# EAGLE design GabozeLite (EAGLE 9.5.0)

## Sheet 1 of 7: POWER (SOURCE, BATTERY, CHARGE, CONTROL)
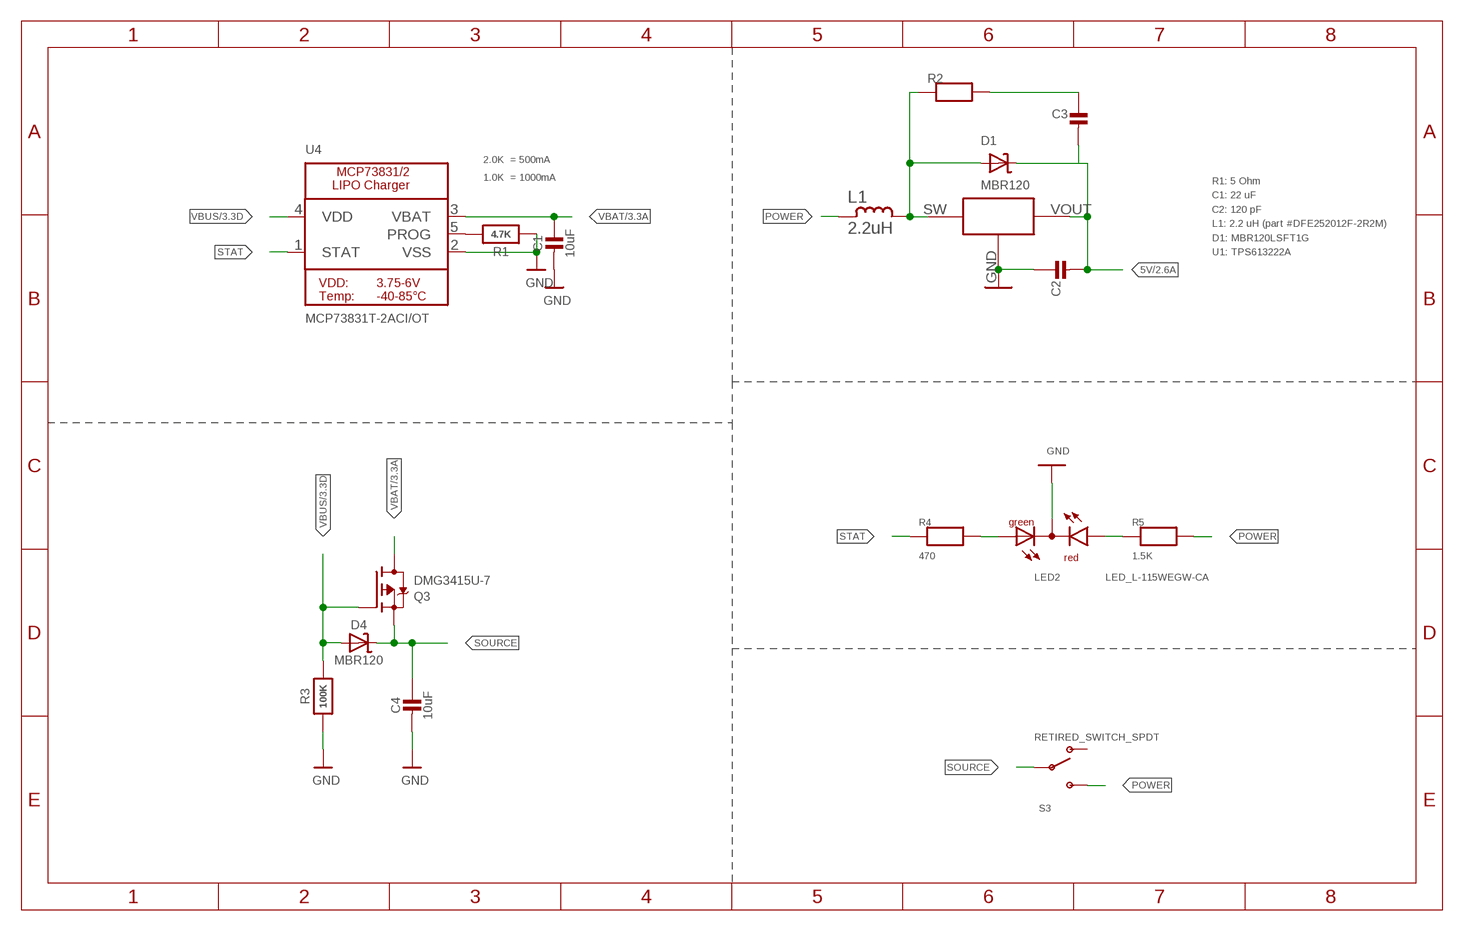
[diagram p0: schematic, sheet 1]

### Parts
C1  10uF  CAP_CERAMIC  [0603-MINI-CAP]
C2  22uf  CAP_CERAMIC  [0603-MINI-CAP]
C3  120pf  CAP_CERAMIC  [0603-MINI-CAP]
C4  10uF  CAP_CERAMIC  [0603-MINI-CAP]
D1  MBR120  DIODE-SCHOTTKYSOD-123  [SOD-123]
D4  MBR120  DIODE-SCHOTTKYSOD-123  [SOD-123]
L1  2.2uH  L-1008CS  [L1008CS]
LED2  LED_L-115WEGW-CA  [LED_DUOLED-A-3MM]
Q3  DMG3415U-7  MOSFET-P  [SOT23-R]
R1  4.7K  RESISTOR0603MINI  [0603-MINI]
R2  5Ohm  RESISTOR0603MINI  [0603-MINI]
R3  100K  RESISTOR0603MINI  [0603-MINI]
R4  470  RESISTOR0603MINI  [0603-MINI]
R5  1.5K  RESISTOR0603MINI  [0603-MINI]
S3  RETIRED_SWITCH_SPDT  [RETIRED_KPS-1290]
U1  TPS613222A  [TPS613222A]
U4  MCP73831T-2ACI/OT  MCP73831/2  [SOT23-5-1]

### Nets
5V: C2.2 C3.2 D1.C U1.VOUT ; also sheet 2
GND: C1.2 C2.1 C4.2 LED2.2(A) R1.1 R3.1 U1.GND U4.2(VSS) ; also sheet 2,3,4,5,6
N$1: D1.A L1.2 R2.1 U1.SW
N$2: C3.1 R2.2
POWER: L1.1 R5.2 S3.S
POWER_LED: LED2.3(CR) R5.1
PROG: R1.2 U4.5(PROG)
SOURCE: C4.1 D4.C Q3.2(S) S3.P
STAT: R4.1 U4.1(STAT)
STAT_LED: LED2.1(CG) R4.2
VBAT: C1.1 Q3.3(D) U4.3(VBAT) ; also sheet 3
VBUS: D4.A Q3.1(G) R3.2 U4.4(VDD) ; also sheet 3
Unconnected: S3.O

### Notes on the sheet
- 2.0K  = 500mA
- 1.0K  = 1000mA
- R1: 5 Ohm
  C1: 22 uF
  C2: 120 pF
  L1: 2.2 uH (part #DFE252012F-2R2M)
  D1: MBR120LSFT1G
  U1: TPS613222A

## Sheet 2 of 7
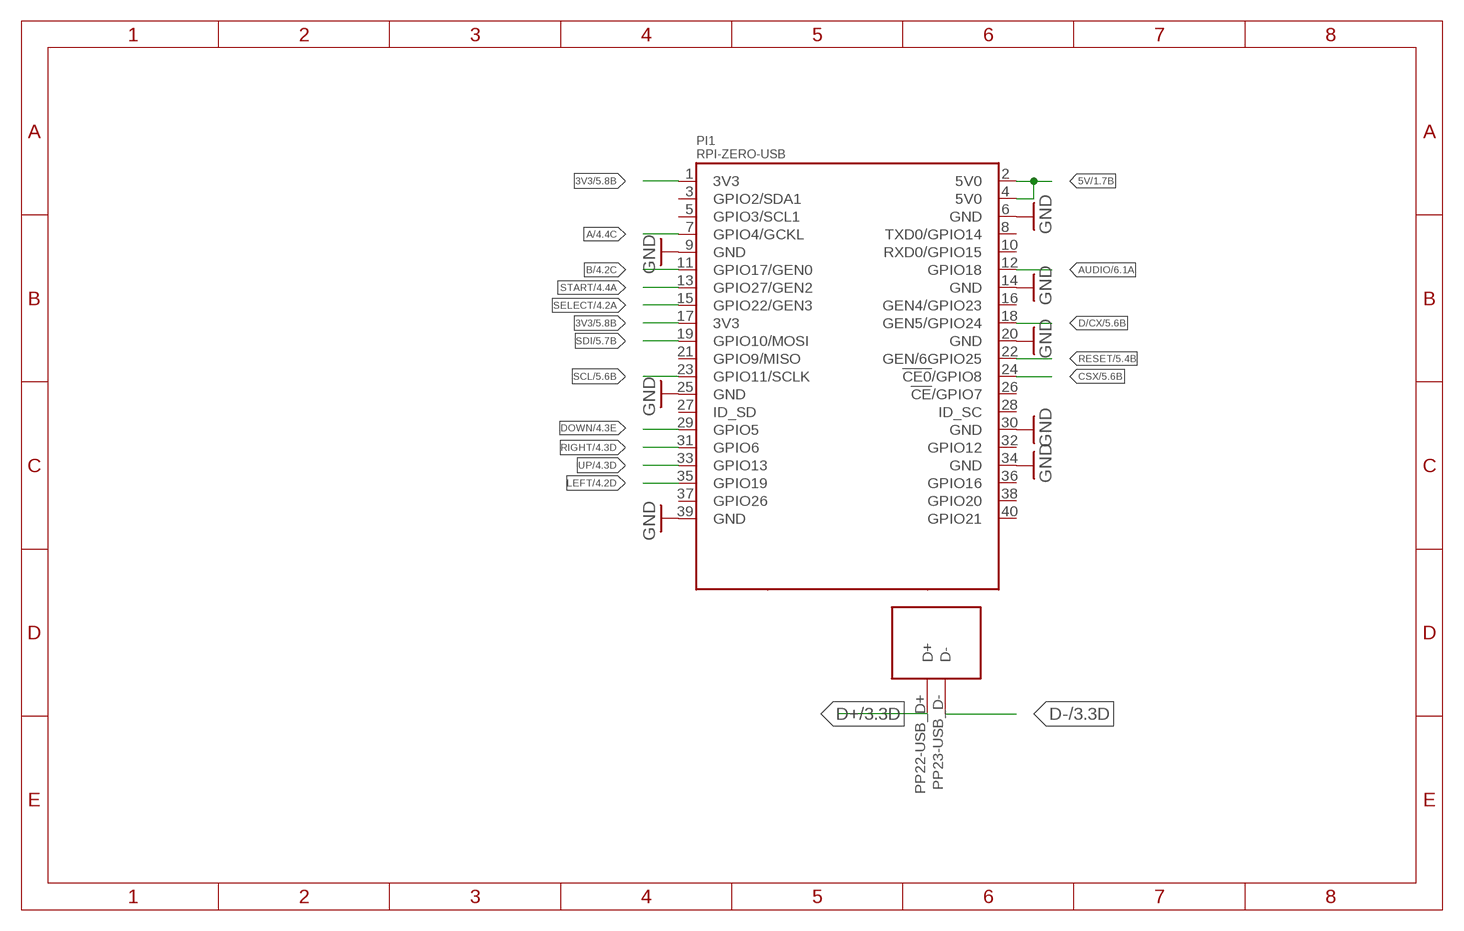
[diagram p1: schematic, sheet 2]

### Parts
PI1  RPI-ZERO-USB  [RPI-ZERO-TH-USB-POGO]

### Nets
3V3: PI1.1(3V3) PI1.17(3V3) ; also sheet 5,6
5V: PI1.2(5V0) PI1.4(5V0) ; also sheet 1
A: PI1.7(GPIO4/GCKL) ; also sheet 4
AUDIO: PI1.12(GPIO18) ; also sheet 6
B: PI1.11(GPIO17/GEN0) ; also sheet 4
CSX: PI1.24(!CE0!/GPIO8) ; also sheet 5
D+: PI1.PP22-USB_D+(D+) ; also sheet 3
D-: PI1.PP23-USB_D-(D-) ; also sheet 3
D/CX: PI1.18(GEN5/GPIO24) ; also sheet 5
DOWN: PI1.29(GPIO5) ; also sheet 4
GND: PI1.6(GND) PI1.9(GND) PI1.14(GND) PI1.20(GND) PI1.25(GND) PI1.30(GND) PI1.34(GND) PI1.39(GND) ; also sheet 1,3,4,5,6
LEFT: PI1.35(GPIO19) ; also sheet 4
RESET: PI1.22(GEN/6GPIO25) ; also sheet 5
RIGHT: PI1.31(GPIO6) ; also sheet 4
SCL: PI1.23(GPIO11/SCLK) ; also sheet 5
SDI: PI1.19(GPIO10/MOSI) ; also sheet 5
SELECT: PI1.15(GPIO22/GEN3) ; also sheet 4
START: PI1.13(GPIO27/GEN2) ; also sheet 4
UP: PI1.33(GPIO13) ; also sheet 4
Unconnected: PI1.3(GPIO2/SDA1) PI1.5(GPIO3/SCL1) PI1.8(TXD0/GPIO14) PI1.10(RXD0/GPIO15) PI1.16(GEN4/GPIO23) PI1.21(GPIO9/MISO) PI1.26(!CE!/GPIO7) PI1.27(ID_SD) PI1.28(ID_SC) PI1.32(GPIO12) PI1.36(GPIO16) PI1.37(GPIO26) PI1.38(GPIO20) PI1.40(GPIO21)

## Sheet 3 of 7: USB + BATTERY
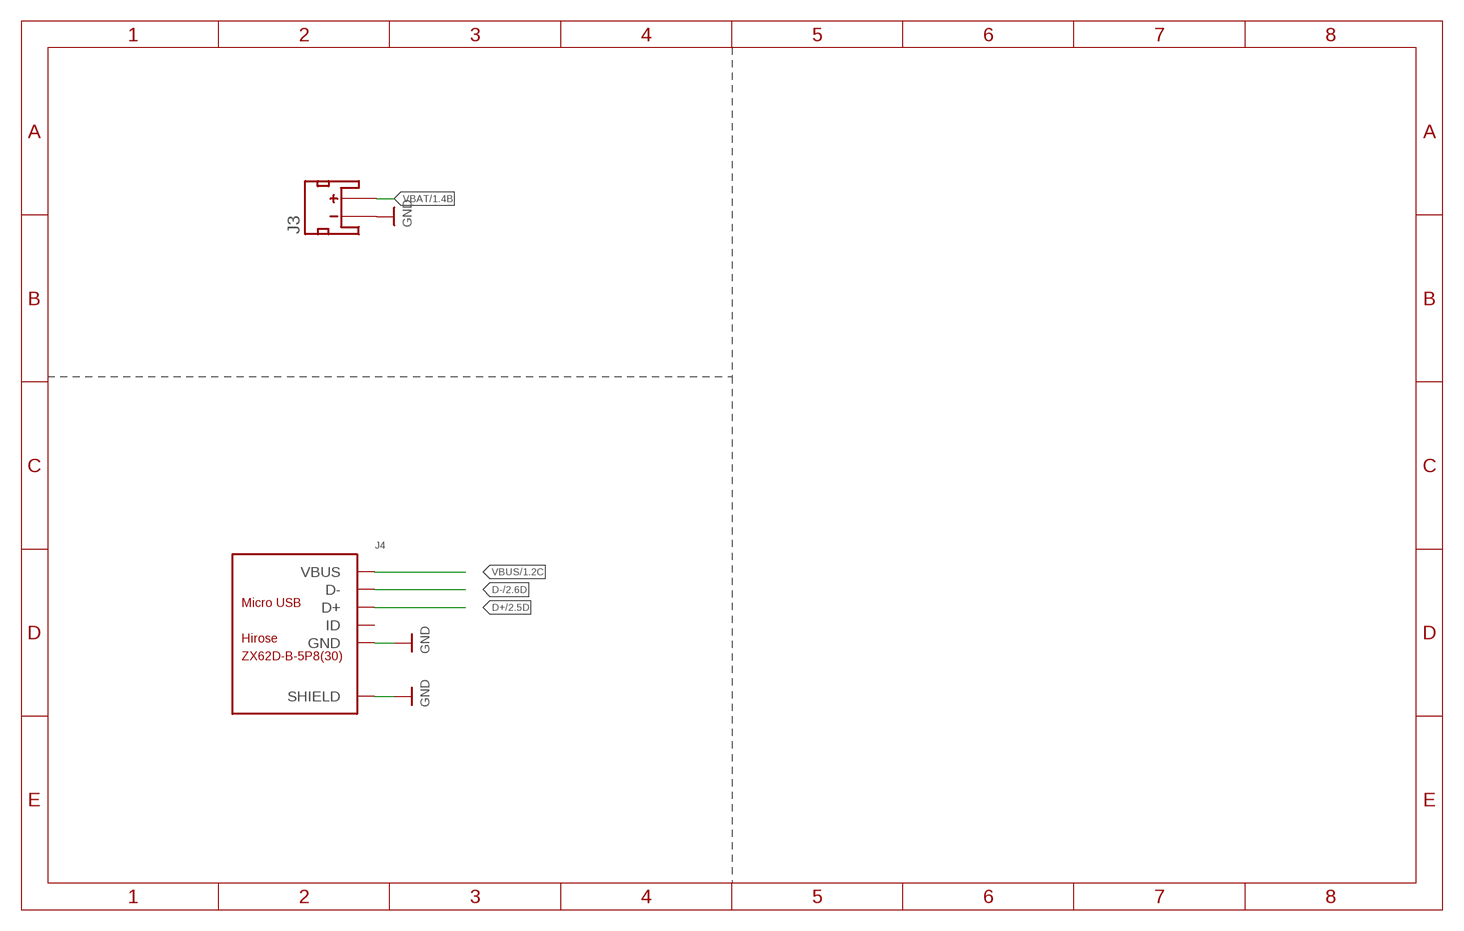
[diagram p2: schematic, sheet 3]

### Parts
J3  Batt Conn  JST_2MM_MALE  [JST-2-SMD]
J4  ZX62D-B-5P8(30)  MICRO-USB-SMD(ZX62D-B-5P8(30))  [MICRO-USB5+6P-SMD-0.65-AB]

### Nets
D+: J4.3(D+) ; also sheet 2
D-: J4.2(D-) ; also sheet 2
GND: J3.1(-) J4.5(GND) J4.P1(SHIELD) J4.P2(SHIELD) J4.P3(SHIELD) J4.P4(SHIELD) J4.P5(SHIELD) J4.P6(SHIELD) ; also sheet 1,2,4,5,6
VBAT: J3.2(+) ; also sheet 1
VBUS: J4.1(VBUS) ; also sheet 1
Unconnected: J3.NC1(PAD1) J3.NC2(PAD2) J4.4(ID)

## Sheet 4 of 7: GPIO
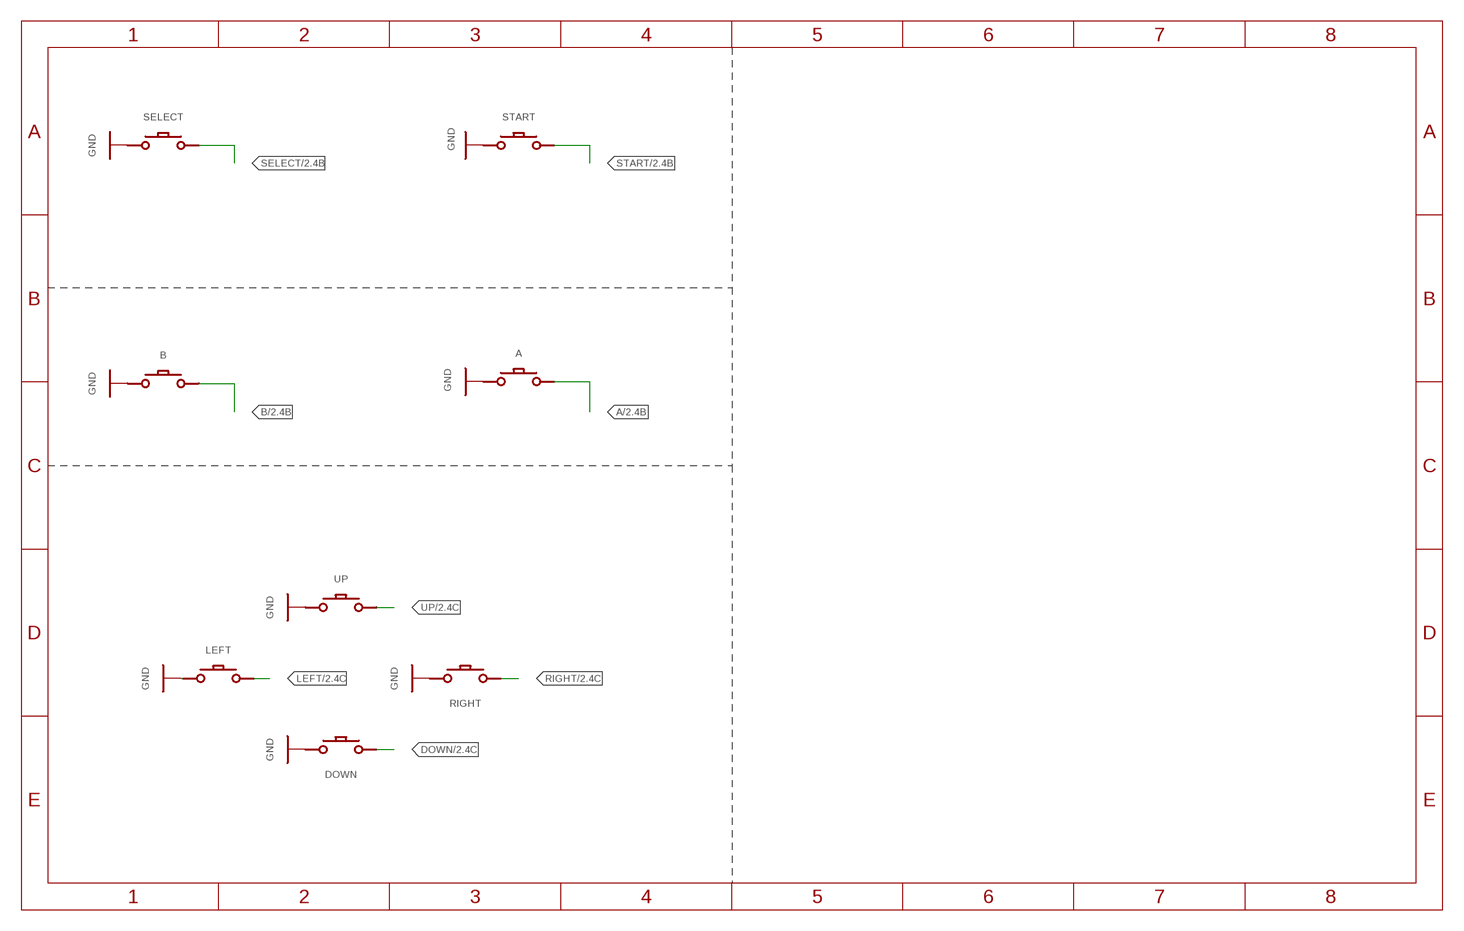
[diagram p3: schematic, sheet 4]

### Parts
A  CONDUCTIVE_BUTTONCONDUCTIVE_BUTTON_THICK  [CONDUCTIVE_BUTTON_THICK]
B  CONDUCTIVE_BUTTONCONDUCTIVE_BUTTON_THICK  [CONDUCTIVE_BUTTON_THICK]
DOWN  CONDUCTIVE_BUTTONCONDUCTIVE_BUTTON_DIRECTIONAL_THICK  [CONDUCTIVE_BUTTON_DIRECTIONAL_THICK]
LEFT  CONDUCTIVE_BUTTONCONDUCTIVE_BUTTON_DIRECTIONAL_THICK  [CONDUCTIVE_BUTTON_DIRECTIONAL_THICK]
RIGHT  CONDUCTIVE_BUTTONCONDUCTIVE_BUTTON_DIRECTIONAL_THICK  [CONDUCTIVE_BUTTON_DIRECTIONAL_THICK]
SELECT  CONDUCTIVE_BUTTON_STARTSELECTCONDUCTIVE_BUTTON_THICK_STARTSELECT  [CONDUCTIVE_BUTTON_THICK_STARTSELECT]
START  CONDUCTIVE_BUTTON_STARTSELECTCONDUCTIVE_BUTTON_THICK_STARTSELECT  [CONDUCTIVE_BUTTON_THICK_STARTSELECT]
UP  CONDUCTIVE_BUTTONCONDUCTIVE_BUTTON_DIRECTIONAL_THICK  [CONDUCTIVE_BUTTON_DIRECTIONAL_THICK]

### Nets
A: A.P$ACTIVE ; also sheet 2
B: B.P$ACTIVE ; also sheet 2
DOWN: DOWN.P$ACTIVE ; also sheet 2
GND: A.P$GND B.P$GND DOWN.P$GND LEFT.P$GND RIGHT.P$GND SELECT.P$GND SELECT.P$GND1(P$GND) SELECT.P$GND2(P$GND) SELECT.P$GND3(P$GND) START.P$GND START.P$GND1(P$GND) START.P$GND2(P$GND) START.P$GND3(P$GND) UP.P$GND ; also sheet 1,2,3,5,6
LEFT: LEFT.P$ACTIVE ; also sheet 2
RIGHT: RIGHT.P$ACTIVE ; also sheet 2
SELECT: SELECT.P$ACTIVE SELECT.P$ACTIVE1(P$ACTIVE) SELECT.P$ACTIVE2(P$ACTIVE) SELECT.P$ACTIVE3(P$ACTIVE) SELECT.P$ACTIVE4(P$ACTIVE) SELECT.P$ACTIVE5(P$ACTIVE) SELECT.P$ACTIVE6(P$ACTIVE) ; also sheet 2
START: START.P$ACTIVE START.P$ACTIVE1(P$ACTIVE) START.P$ACTIVE2(P$ACTIVE) START.P$ACTIVE3(P$ACTIVE) START.P$ACTIVE4(P$ACTIVE) START.P$ACTIVE5(P$ACTIVE) START.P$ACTIVE6(P$ACTIVE) ; also sheet 2
UP: UP.P$ACTIVE ; also sheet 2

## Sheet 5 of 7: SCREEN + BRIGHTNESS
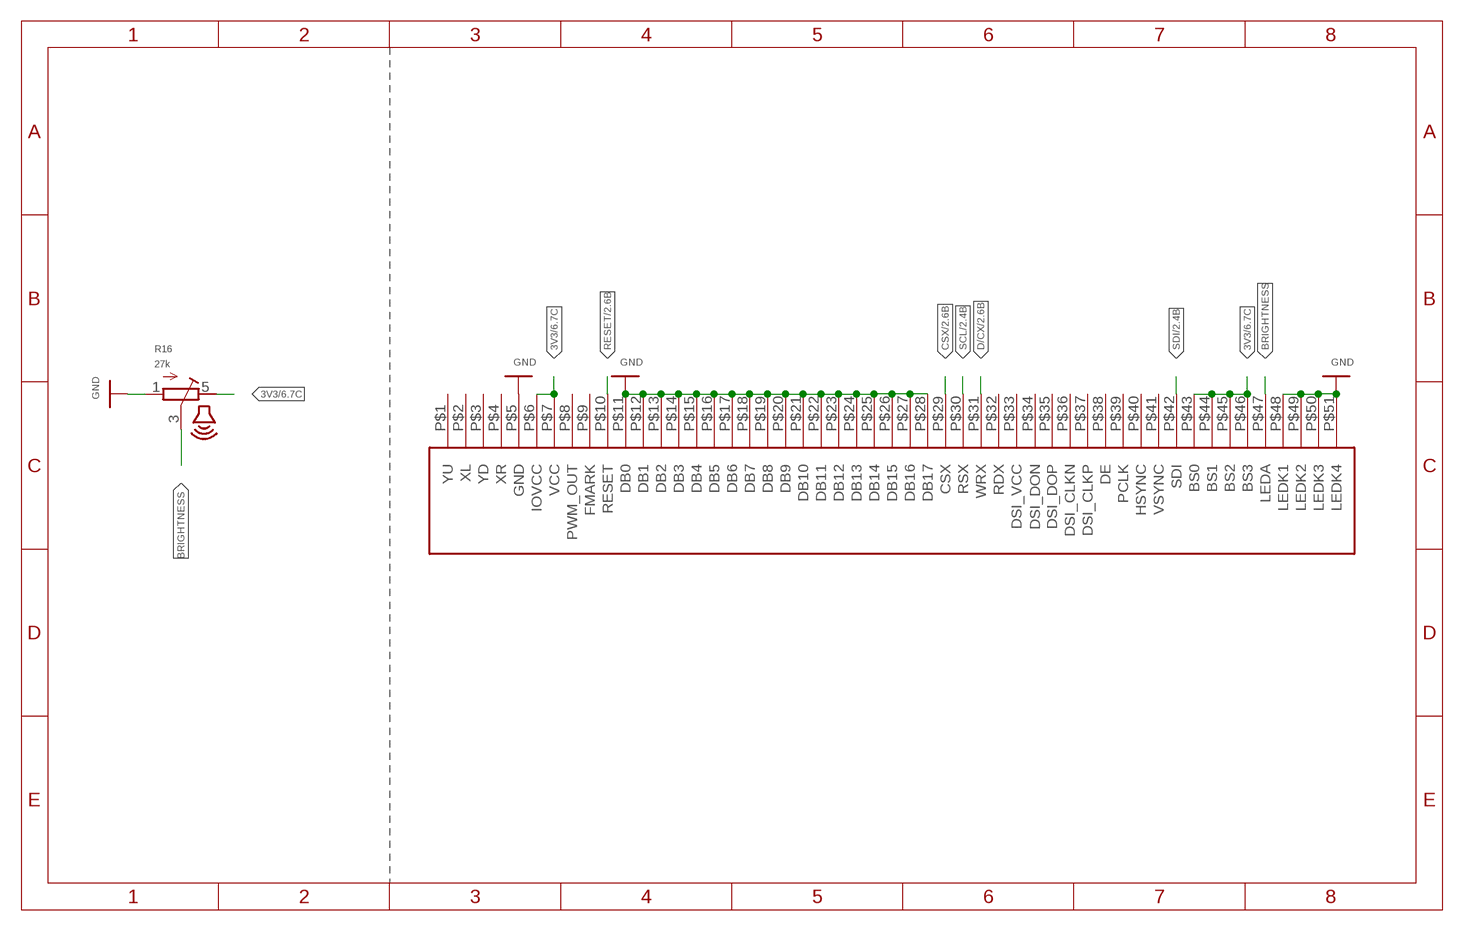
[diagram p4: schematic, sheet 5]

### Parts
R16  27k  THUMBWHEEL  [THUMBWHEEL]
U5  ILI9342-2.6"  [ILI9342-2.6"]

### Nets
3V3: R16.5(E) U5.P$6(IOVCC) U5.P$7(VCC) U5.P$43(BS0) U5.P$44(BS1) U5.P$45(BS2) U5.P$46(BS3) ; also sheet 2,6
BRIGHTNESS: R16.3(S) U5.P$47(LEDA)
CSX: U5.P$29(CSX) ; also sheet 2
D/CX: U5.P$31(WRX) ; also sheet 2
GND: R16.1(A) U5.P$5(GND) U5.P$11(DB0) U5.P$12(DB1) U5.P$13(DB2) U5.P$14(DB3) U5.P$15(DB4) U5.P$16(DB5) U5.P$17(DB6) U5.P$18(DB7) U5.P$19(DB8) U5.P$20(DB9) U5.P$21(DB10) U5.P$22(DB11) U5.P$23(DB12) U5.P$24(DB13) U5.P$25(DB14) U5.P$26(DB15) U5.P$27(DB16) U5.P$28(DB17) U5.P$48(LEDK1) U5.P$49(LEDK2) U5.P$50(LEDK3) U5.P$51(LEDK4) ; also sheet 1,2,3,4,6
RESET: U5.P$10(RESET) ; also sheet 2
SCL: U5.P$30(RSX) ; also sheet 2
SDI: U5.P$42(SDI) ; also sheet 2
Unconnected: U5.P$1(YU) U5.P$2(XL) U5.P$3(YD) U5.P$4(XR) U5.P$8(PWM_OUT) U5.P$9(FMARK) U5.P$32(RDX) U5.P$33(DSI_VCC) U5.P$34(DSI_DON) U5.P$35(DSI_DOP) U5.P$36(DSI_CLKN) U5.P$37(DSI_CLKP) U5.P$38(DE) U5.P$39(PCLK) U5.P$40(HSYNC) U5.P$41(VSYNC)

## Sheet 6 of 7: AUDIO
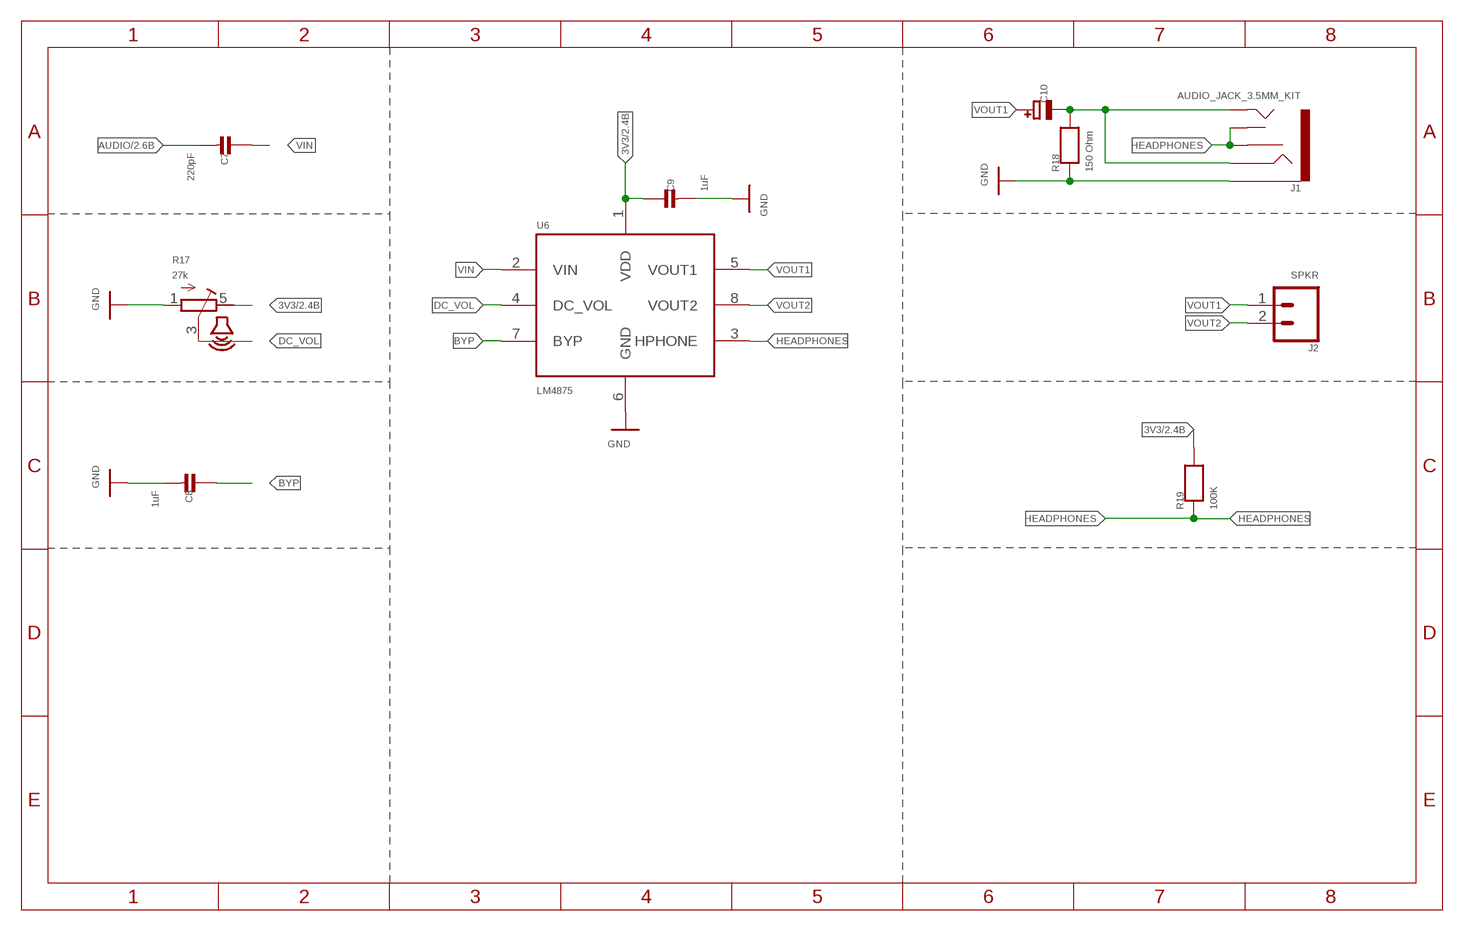
[diagram p5: schematic, sheet 6]

### Parts
C7  220pF  CAP_CERAMIC  [0603-MINI-CAP]
C8  1uF  CAP_CERAMIC  [0603-MINI-CAP]
C9  1uF  CAP_CERAMIC  [0603-MINI-CAP]
C10  100uF  CAP_TANTALUMA/3216_WAVE  [EIA3216-18/A-W]
J1  AUDIO_JACK_3.5MM_KIT  [AUDIO-JACK-KIT]
J2  SPKR  CONN_02  [1X02]
R17  27k  THUMBWHEEL  [THUMBWHEEL]
R18  150 Ohm  RESISTOR0603MINI  [0603-MINI]
R19  100K  RESISTOR0603MINI  [0603-MINI]
U6  LM4875  [SOIC8]

### Nets
3V3: C9.1 R17.5(E) R19.2 U6.1(VDD) ; also sheet 2,5
AUDIO: C7.2 ; also sheet 2
BYP: C8.1 U6.7(BYP)
DC_VOL: R17.3(S) U6.4(DC_VOL)
GND: C8.2 C9.2 J1.SLEEVE R17.1(A) R18.1 U6.6(GND) ; also sheet 1,2,3,4,5
HEADPHONES: J1.RSH J1.TSH R19.1 U6.3(HPHONE)
VIN: C7.1 U6.2(VIN)
VIN1: C10.- J1.RING J1.TIP R18.2
VOUT1: C10.+ J2.1 U6.5(VOUT1)
VOUT2: J2.2 U6.8(VOUT2)

## Sheet 7 of 7: BOARD
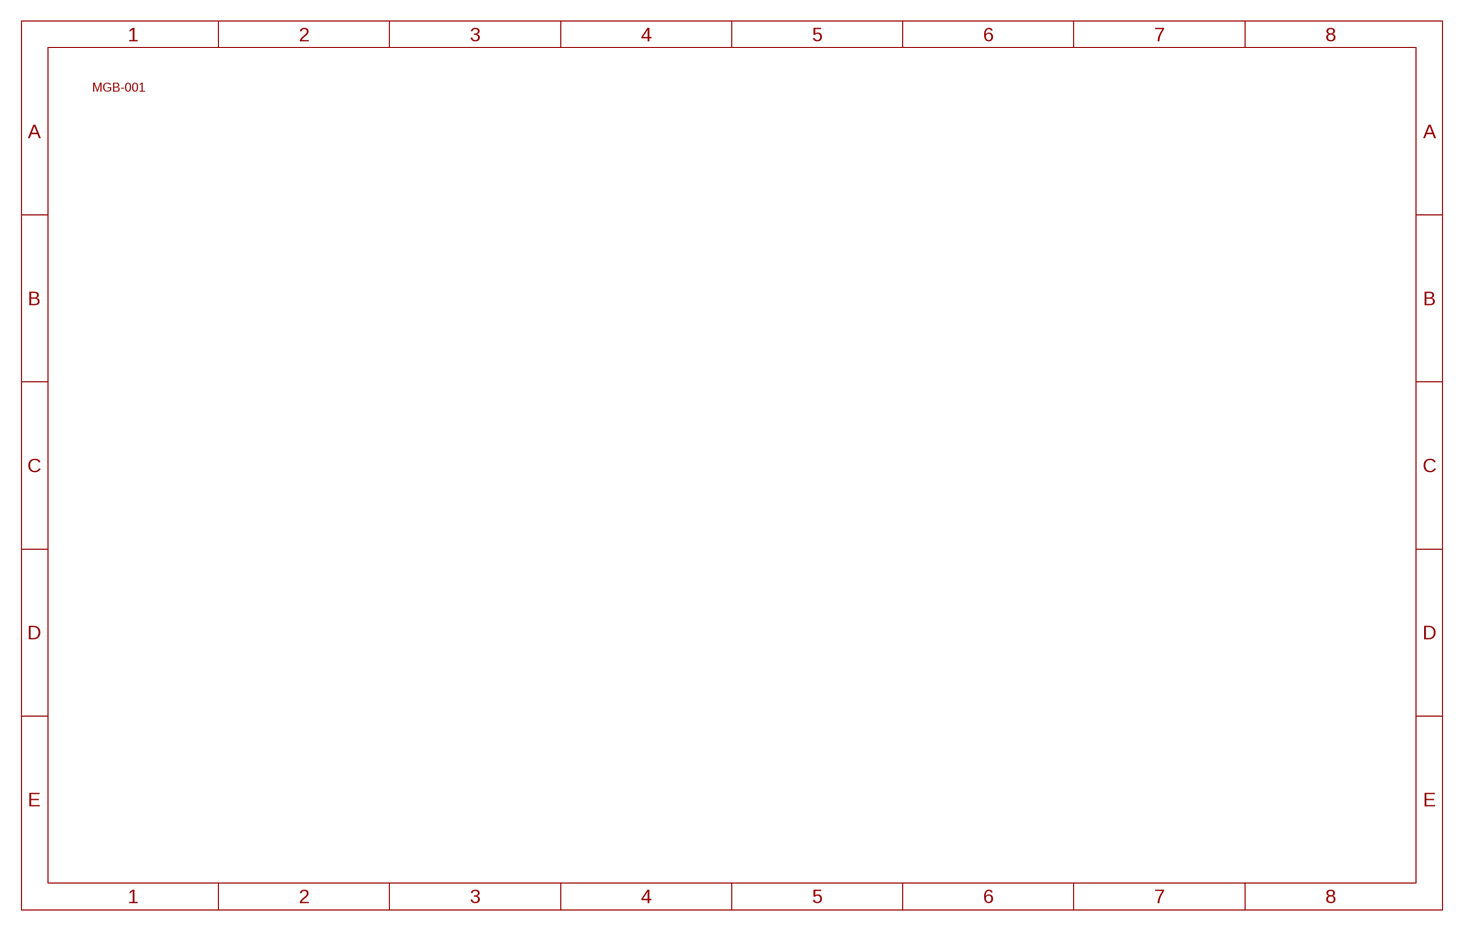
[diagram p6: schematic, sheet 7]

### Parts
U$1  MGB-001  [MGB-001]

## Library data of the parts
A B DOWN LEFT RIGHT UP = RetroESP32:CONDUCTIVE_BUTTON
C1 C4 = RetroESP32:CAP_CERAMIC: Ceramic Capacitors For new designs, use the packages preceded by an '_' character since they are more reliable: The following footprints should be used on most boards: _0402 - Standard footprint for regular board layouts _0603 - Standard footprint for regular board layouts _0805 - Standard footprint for regular board layouts _1206 - Standard footprint for regular board layouts For extremely tight-pitch boards where space is at a premium, the following 'micro-pitch' footprints can be used (smaller pads, no silkscreen outline, etc.): _0402MP - Micro-pitch footprint for very dense/compact boards _0603MP - Micro-pitch footprint for very dense/compact boards _0805MP - Micro-pitch footprint for very dense/compact boards _1206MP - Micro-pitch footprint for very dense/compact boards; MPN: CL10A106MP8NNNC
C2 C3 = RetroESP32:CAP_CERAMIC: Ceramic Capacitors For new designs, use the packages preceded by an '_' character since they are more reliable: The following footprints should be used on most boards: _0402 - Standard footprint for regular board layouts _0603 - Standard footprint for regular board layouts _0805 - Standard footprint for regular board layouts _1206 - Standard footprint for regular board layouts For extremely tight-pitch boards where space is at a premium, the following 'micro-pitch' footprints can be used (smaller pads, no silkscreen outline, etc.): _0402MP - Micro-pitch footprint for very dense/compact boards _0603MP - Micro-pitch footprint for very dense/compact boards _0805MP - Micro-pitch footprint for very dense/compact boards _1206MP - Micro-pitch footprint for very dense/compact boards
C7 = RetroESP32:CAP_CERAMIC: Ceramic Capacitors For new designs, use the packages preceded by an '_' character since they are more reliable: The following footprints should be used on most boards: _0402 - Standard footprint for regular board layouts _0603 - Standard footprint for regular board layouts _0805 - Standard footprint for regular board layouts _1206 - Standard footprint for regular board layouts For extremely tight-pitch boards where space is at a premium, the following 'micro-pitch' footprints can be used (smaller pads, no silkscreen outline, etc.): _0402MP - Micro-pitch footprint for very dense/compact boards _0603MP - Micro-pitch footprint for very dense/compact boards _0805MP - Micro-pitch footprint for very dense/compact boards _1206MP - Micro-pitch footprint for very dense/compact boards; MPN: CL10C221JB8NNNC
C8 C9 = RetroESP32:CAP_CERAMIC: Ceramic Capacitors For new designs, use the packages preceded by an '_' character since they are more reliable: The following footprints should be used on most boards: _0402 - Standard footprint for regular board layouts _0603 - Standard footprint for regular board layouts _0805 - Standard footprint for regular board layouts _1206 - Standard footprint for regular board layouts For extremely tight-pitch boards where space is at a premium, the following 'micro-pitch' footprints can be used (smaller pads, no silkscreen outline, etc.): _0402MP - Micro-pitch footprint for very dense/compact boards _0603MP - Micro-pitch footprint for very dense/compact boards _0805MP - Micro-pitch footprint for very dense/compact boards _1206MP - Micro-pitch footprint for very dense/compact boards; MPN: CL10A105KP8NNNC
C10 = RetroESP32:CAP_TANTALUM: Tantalum Capacitors Wave footprints have larger pads and are meant to be used for hand soldering. Reflow footprints are optimised for solder paste and a reflow oven. EIA3216-18/A-[R/W] - Size A / 3216-18 / 1206 footprint 4.7µF 25V 10% Tantalum Capacitor 10µF 16V 10% Tantalum Capacitor [Digikey: 495-2236-2-ND] EIA3528-21/B-[R/W] - Size B / 3528-21 47µF 10V 10% Tantalum Capactior [Digikey: 495-2216-1-ND] EIA6032-28/C-[R/W] - Size C / 6032-28 10µF 35V 20% Tantalum Capacitor [Digikey: 495-2285-1-ND] 100µF 16V 10% Tantalum Capactior [Digikey: 399-5214-1-ND]; MPN: 6TPH100MAEA
D1 D4 = RetroESP32:DIODE-SCHOTTKY; MPN: MBR120LSFT1G
J1 = RetroESP32:AUDIO_JACK_3.5MM: Audio Jack 3.5mm variants of PTH and SMT stereo audio jack with bypass switches. SparkFun Products: SparkFun SparkPunk Sound Kit <[https://www.sparkfun.com/products/11177]> - PTH MP3 Trigger <https://www.sparkfun.com/products/13720> -3.5mm SMD SparkFun PicoBoard <https://www.sparkfun.com/products/11888>- 2.5mm SMD; MPN: SJ1-3525NG-GR; PROD_ID: CONN-10353; SF_ID: PRT-08032
J2 = RetroESP32:CONN_02: Multi connection point. Often used as Generic Header-pin footprint for 0.1 inch spaced/style header connections On any of the 0.1 inch spaced packages, you can populate with these: Break Away Headers - Straight <https://www.sparkfun.com/products/116> (PRT-00116) Break Away Male Headers - Right Angle <https://www.sparkfun.com/products/553> (PRT-00553) Female Headers <https://www.sparkfun.com/products/115> (PRT-00115) Break Away Headers - Machine Pin <https://www.sparkfun.com/products/117> (PRT-00117) Break Away Female Headers - Swiss Machine Pin <https://www.sparkfun.com/products/743> (PRT-00743) For SCREWTERMINALS and SPRING TERMINALS visit here: Screw Terimnals on SparkFun.com <https://www.sparkfun.com/search/results?term=Screw+Terminals> (5mm/3.5mm/2.54mm spacing) This device is also useful as a general connection point to wire up your design to another part of your project. Our various solder wires solder well into these plated through hole pads. Hook-Up Wire - Assortment (Stranded, 22 AWG) <https://www.sparkfun.com/products/11375> (PRT-11375) Hook-Up Wire - Assortment (Solid Core, 22 AWG) <https://www.sparkfun.com/products/11367> (PRT-11367) View the entire wire category on our website here <https://www.sparkfun.com/categories/141> Special notes: Molex polarized connector foot print use with: PRT-08233 with associated crimp pins and housings. 2.54_SCREWTERM for use with PRT-10571. 3.5mm Screw Terminal footprints for PRT-08084 5mm Screw Terminal footprints for use with PRT-08432; PROD_ID: CONN-13512; SF_ID: PRT-09918; SF_SKU: PRT-08432; SKU: PRT-09914
J3 = RetroESP32:JST_2MM_MALE: JST 2MM MALE RA CONNECTOR Two pin, compact surface mount connector. Commonly used as a battery input connection point. We really like the solid locking feeling and high current rating on these small connectors. We use these all the time as battery connectors. Mates to single-cell LiPo batteries. Here is the connector we sell at SparkFun: JST Right Angle Connector - White <https://www.sparkfun.com/products/8612> (PRT-08612) Datasheet <http://www.sparkfun.com/datasheets/Prototyping/Connectors/JST-Horizontal.pdf> It was used on these SparkFun products: SparkFun MOSFET Power Controller <https://www.sparkfun.com/products/11214> (PRT-11214) SparkFun Battery Babysitter - LiPo Battery Manager <https://www.sparkfun.com/products/13777> (PRT-13777) And many, many others that required a lipo battery connection.; MPN: S2B-PH-SM4-TB(LF)(SN); PROD_ID: CONN-11443; SF_ID: PRT-08612
J4 = RetroESP32:MICRO-USB-SMD(ZX62D-B-5P8(30)): 320010005; MPN: ZX62D-B-5P8(30)
L1 = inductor-coilcraft:L-: SMD INDUCTOR
LED2 = RetroESP32:LED_L-115WEGW-CA: T-1(3mm) BI-COLOR INDICATOR LAMP Source: Kingbright .. 2_colour_led_.pdf; MPN: SSL-LX3059IGW
PI1 = 32teeth - Gaboze-Pi:RPI-ZERO-USB
Q3 = RetroESP32:MOSFET-P: P-Channel Mosfet LEGEND VDS: Voltage Drain-Source ID: Drain Current RDS(ON): Drain-Source On-State Resistance VGS(TH): Gate-Source Threshold Voltage CISS: Drain-Source Input Capacitance SOT-23 Name VDS ID RDS(ON) VGS(TH) CISS Order Number IRLML5103 30V 760mA 600 mOhm -- 75pF @ 25V Digikey: IRLML5103PBFCT-ND IRLML6401 12V 4.3A 50 mOhm 950mV @ 250µA 830pF @ 10V Digikey: IRLML6401PBFTR-ND NTR0202PL 20V 400mA 800 mOhm 2.3V @ 250uA 70pF @ 5V Digikey: NTR0202PLT1GOSTR-ND NTR4101PT1G 20V 1.8A 85 mOhm 1.2V @ 250uA 675pF @ 10V Digikey: NTR4101PT1GOSCT-ND DMP2004K 20V 600mA 900 mOhm 1V @ 250uA 175pF @ 16V Digikey: DMP2004KDICT-ND PMV65XP 20V 3.9A 76 mOhm 950mV @ 1mA 725pF @ 20V Digikey: 568-2358-2-ND TO-252 Name VDS ID RDS(ON) VGS(TH) CISS Order Number AOD417 30V 25A 34 mOhm 3V @ 250µA 920pF @ 15V Digikey: 785-1106-2-ND; MPN: DMG3415U-7
R1 = RetroESP32:RESISTOR: Resistors For new designs, use the packages preceded by an '_' character since they are more reliable: The following footprints should be used on most boards: _0402 - Standard footprint for regular board layouts _0603 - Standard footprint for regular board layouts _0805 - Standard footprint for regular board layouts _1206 - Standard footprint for regular board layouts For extremely tight-pitch boards where space is at a premium, the following 'micro-pitch' footprints can be used (smaller pads, no silkscreen outline, etc.): _0402MP - Micro-pitch footprint for very dense/compact boards _0603MP - Micro-pitch footprint for very dense/compact boards _0805MP - Micro-pitch footprint for very dense/compact boards _1206MP - Micro-pitch footprint for very dense/compact boards; MPN: ERJ-PA3J472V
R2 = RetroESP32:RESISTOR: Resistors For new designs, use the packages preceded by an '_' character since they are more reliable: The following footprints should be used on most boards: _0402 - Standard footprint for regular board layouts _0603 - Standard footprint for regular board layouts _0805 - Standard footprint for regular board layouts _1206 - Standard footprint for regular board layouts For extremely tight-pitch boards where space is at a premium, the following 'micro-pitch' footprints can be used (smaller pads, no silkscreen outline, etc.): _0402MP - Micro-pitch footprint for very dense/compact boards _0603MP - Micro-pitch footprint for very dense/compact boards _0805MP - Micro-pitch footprint for very dense/compact boards _1206MP - Micro-pitch footprint for very dense/compact boards
R3 R19 = RetroESP32:RESISTOR: Resistors For new designs, use the packages preceded by an '_' character since they are more reliable: The following footprints should be used on most boards: _0402 - Standard footprint for regular board layouts _0603 - Standard footprint for regular board layouts _0805 - Standard footprint for regular board layouts _1206 - Standard footprint for regular board layouts For extremely tight-pitch boards where space is at a premium, the following 'micro-pitch' footprints can be used (smaller pads, no silkscreen outline, etc.): _0402MP - Micro-pitch footprint for very dense/compact boards _0603MP - Micro-pitch footprint for very dense/compact boards _0805MP - Micro-pitch footprint for very dense/compact boards _1206MP - Micro-pitch footprint for very dense/compact boards; MPN: ERJ-PA3J104V
R4 = RetroESP32:RESISTOR: Resistors For new designs, use the packages preceded by an '_' character since they are more reliable: The following footprints should be used on most boards: _0402 - Standard footprint for regular board layouts _0603 - Standard footprint for regular board layouts _0805 - Standard footprint for regular board layouts _1206 - Standard footprint for regular board layouts For extremely tight-pitch boards where space is at a premium, the following 'micro-pitch' footprints can be used (smaller pads, no silkscreen outline, etc.): _0402MP - Micro-pitch footprint for very dense/compact boards _0603MP - Micro-pitch footprint for very dense/compact boards _0805MP - Micro-pitch footprint for very dense/compact boards _1206MP - Micro-pitch footprint for very dense/compact boards; MPN: ERJ-PA3J471V
R5 = RetroESP32:RESISTOR: Resistors For new designs, use the packages preceded by an '_' character since they are more reliable: The following footprints should be used on most boards: _0402 - Standard footprint for regular board layouts _0603 - Standard footprint for regular board layouts _0805 - Standard footprint for regular board layouts _1206 - Standard footprint for regular board layouts For extremely tight-pitch boards where space is at a premium, the following 'micro-pitch' footprints can be used (smaller pads, no silkscreen outline, etc.): _0402MP - Micro-pitch footprint for very dense/compact boards _0603MP - Micro-pitch footprint for very dense/compact boards _0805MP - Micro-pitch footprint for very dense/compact boards _1206MP - Micro-pitch footprint for very dense/compact boards; MPN: ERJ-PA3J152V
R16 R17 = RetroESP32:THUMBWHEEL
R18 = RetroESP32:RESISTOR: Resistors For new designs, use the packages preceded by an '_' character since they are more reliable: The following footprints should be used on most boards: _0402 - Standard footprint for regular board layouts _0603 - Standard footprint for regular board layouts _0805 - Standard footprint for regular board layouts _1206 - Standard footprint for regular board layouts For extremely tight-pitch boards where space is at a premium, the following 'micro-pitch' footprints can be used (smaller pads, no silkscreen outline, etc.): _0402MP - Micro-pitch footprint for very dense/compact boards _0603MP - Micro-pitch footprint for very dense/compact boards _0805MP - Micro-pitch footprint for very dense/compact boards _1206MP - Micro-pitch footprint for very dense/compact boards; MPN: ERJ-PA3J151V
S3 = RetroESP32:RETIRED_SWITCH_SPDT: SWCH-10651 Side-actuated SPDT slide switch, as used on the Arduino Pro; MPN: RS-187R05A2-DS MT RT; PROD_ID: SWCH-10651
SELECT START = RetroESP32:CONDUCTIVE_BUTTON_STARTSELECT
U1 = 32teeth - TPS613222A:TPS613222A
U4 = RetroESP32:MCP73831/2: MCP73831/2 LIPO Charger VDD: 3.75 - 6V Temp -40 - 85°C Programmable Charge Rate: 15-500mA NOTE: STAT is a tri-state logic output on the MCP73831 and an open-drain output on the MCP73832. SOT23-5 with 4.2V output and tri-state logic on STAT = MCP73831T-2ACI/OT; MPN: MCP73831T-2ACI/OT
U5 = RetroESP32:ILI9342-2.6": ILI9342 51P 2.6" TFT LCD
U6 = RetroESP32:LM4875; MPN: LM4875M/NOPB
U$1 = RetroESP32:MGB-001: MGB-001 Game Boy Pocket This is the footprint and dimensions outline for the Game Boy Pocket PCB Variants MGB-001 - Standard Game Boy Pocket MGB-001-ESP32 - Game Boy Pocket w/ Antenna Cut Out

## Board
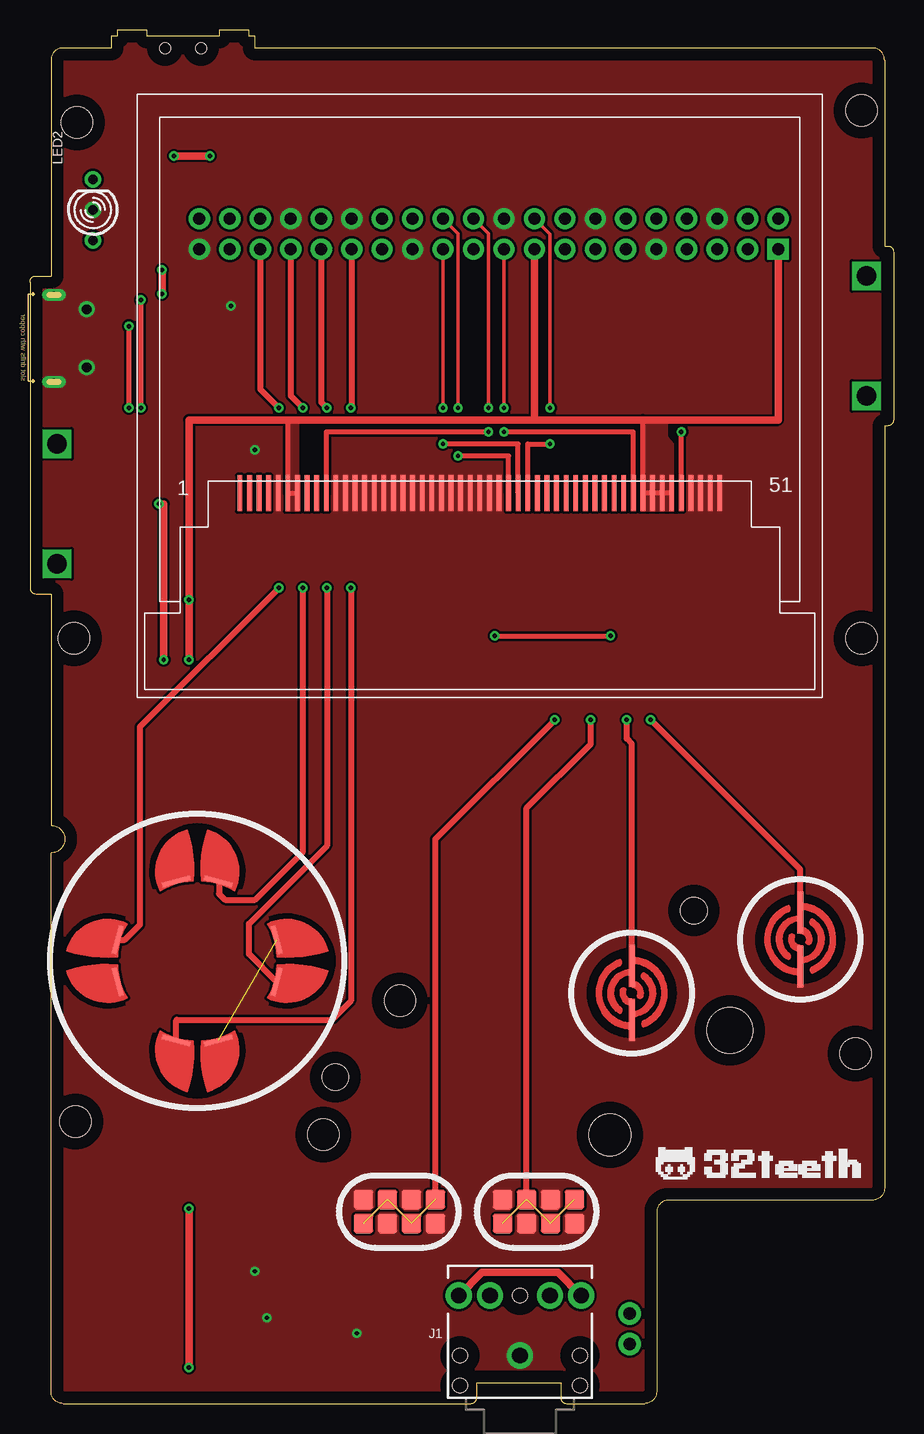
[diagram p7: board, top side]
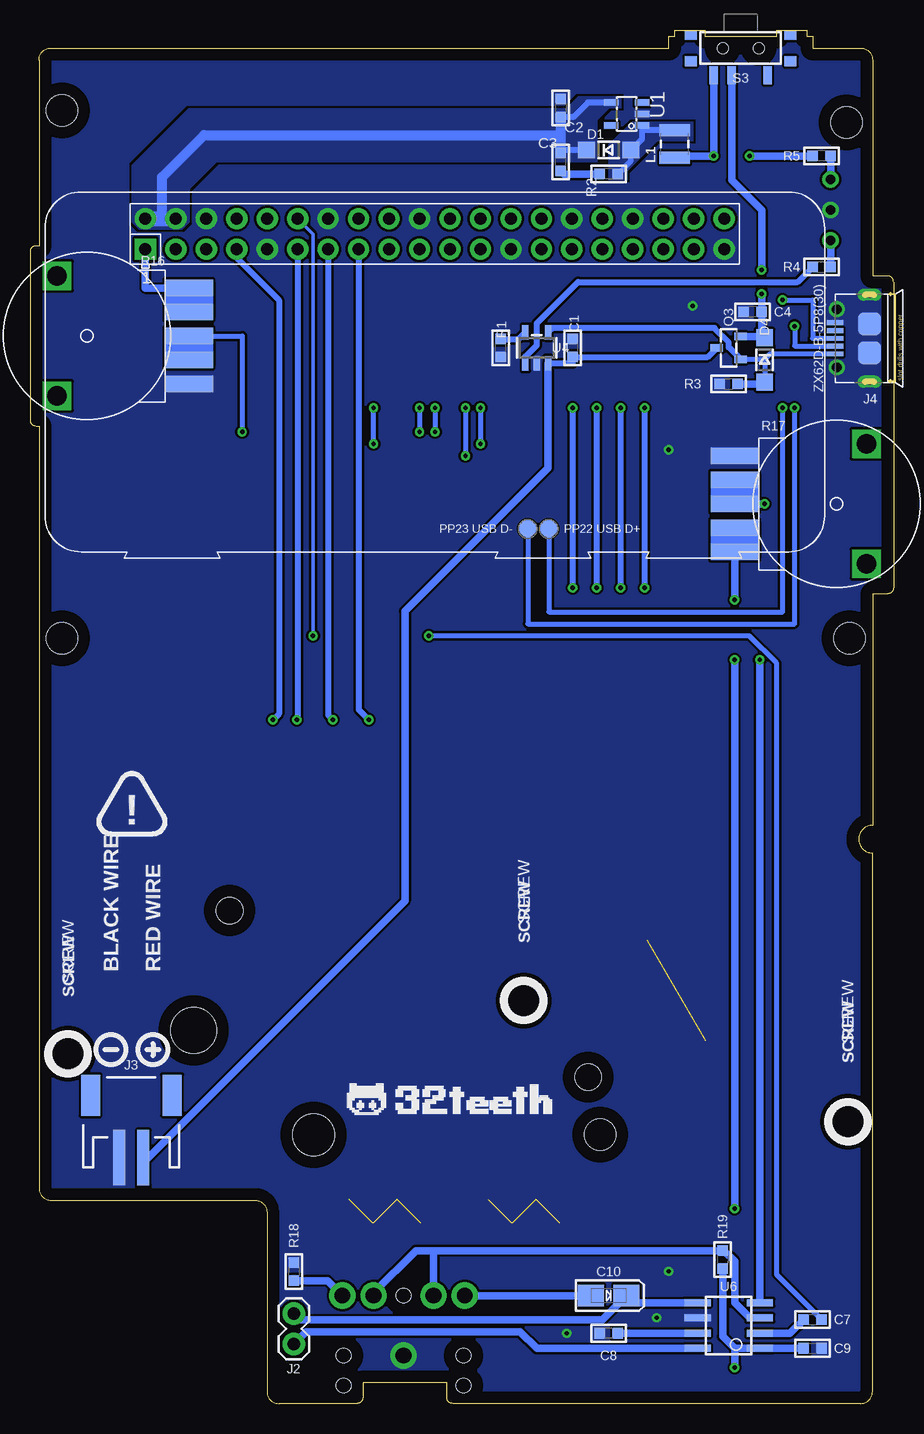
[diagram p8: board, bottom side, seen from below]

Size 72 x 114.5 mm. Coordinates in mm from the lower left corner, seen from the top.
Copper layers (1*16): Top 0.035mm / dielectric 1mm / Bottom 0.035mm
Design rules "default *": minimum track width 8mil, minimum drill 24mil, track to track 8mil, track to pad 8mil, pad to pad 8mil, via to via 8mil, smd to smd 8mil, copper to edge 40mil, drill to drill 8mil, minimum pad ring 10mil, minimum via ring 8mil, stop-mask expansion 5mil, vias tented up to drill 10mil, thermal gap 10mil

### Footprints (pad centres in the part's own frame; a part is rotated, then mirrored left to right if it is on the bottom)
CONDUCTIVE_BUTTON_THICK = smd 0.5 x 3.5: P$ACTIVE 0,-2.25; P$GND 0,2.25
0603-MINI-CAP = smd 0.9 x 0.9: 1 -0.75,0; 2 0.75,0
EIA3216-18/A-W = smd 2.15 x 1.8: + 1.475,0; - -1.475,0
SOD-123 = smd 1.4 x 1.4: A 1.85,0; C -1.85,0
CONDUCTIVE_BUTTON_DIRECTIONAL_THICK = smd 2.4 x 0.4 rotated 75: P$ACTIVE 0.875,1.75 | smd 2.4 x 0.4 rotated 285: P$GND 0.875,-1.75
AUDIO-JACK-KIT = drill 1.3 pad 2.184: RING 5,5.1; RSH 5,2.5; SLEEVE 0,0; TIP 5,-5.1; TSH 5,-2.5 | hole 1.2: 0,5; -2.5,5; -2.5,-5; 0,-5; 5,0
1X02 = drill 1.016 pad 1.88: 1 0,0; 2 2.54,0
JST-2-SMD = smd 1 x 4.6: 1 -1,-3.7; 2 1,-3.7 | smd 1.6 x 3.4: NC1 -3.4,1.5; NC2 3.4,1.5
MICRO-USB5+6P-SMD-0.65-AB = smd 0.4 x 1.35: 1 -1.3,2.875; 2 -0.65,2.875; 3 0,2.875; 4 0.65,2.875; 5 1.3,2.875 | smd 1.9 x 1.9: P1 -1.2,0; P2 1.2,0 | drill 0.508 pad 1.016 long: P3 -3.625,0; P4 3.625,0 | drill 0.8: P5 -2.425,2.73; P6 2.425,2.73
L1008CS = smd 1.02 x 2.54: 1 -1.145,0; 2 1.145,0
LED_DUOLED-A-3MM = drill 0.8 pad 1.4: 1 -2.54,0; 2 0,0; 3 2.54,0
RPI-ZERO-TH-USB-POGO = drill 1 pad 1.778 square: 1 8.37,25.23 | drill 1 pad 1.778: 2 8.37,27.77; 3 10.91,25.23; 4 10.91,27.77; 5 13.45,25.23; 6 13.45,27.77; 7 15.99,25.23; 8 15.99,27.77; 9 18.53,25.23; 10 18.53,27.77; 11 21.07,25.23; 12 21.07,27.77; 13 23.61,25.23; 14 23.61,27.77; 15 26.15,25.23; 16 26.15,27.77; 17 28.69,25.23; 18 28.69,27.77; 19 31.23,25.23; 20 31.23,27.77; 21 33.77,25.23; 22 33.77,27.77; 23 36.31,25.23; 24 36.31,27.77; 25 38.85,25.23; 26 38.85,27.77; 27 41.39,25.23; 28 41.39,27.77; 29 43.93,25.23; 30 43.93,27.77; 31 46.47,25.23; 32 46.47,27.77; 33 49.01,25.23; 34 49.01,27.77; 35 51.55,25.23; 36 51.55,27.77; 37 54.09,25.23; 38 54.09,27.77; 39 56.63,25.23; 40 56.63,27.77 | smd 1.422 x 1.422: PP22-USB_D+ 42,1.9; PP23-USB_D- 40.25,1.9
SOT23-R = smd 0.635 x 1.016: 1 -0.95,-1; 2 0.95,-1; 3 0,1
0603-MINI = smd 0.9 x 0.9: 1 -0.75,0; 2 0.75,0
THUMBWHEEL = smd 1.4 x 4: 1 -4,-2; 2 -2,-2; 3 0,-2; 4 2,-2; 5 4,-2 | drill 1.6 square: P$6 -5,9; P$7 5,9
RETIRED_KPS-1290 = smd 0.7 x 1.5: O -2.25,2.25; P 0.75,2.25; S 2.25,2.25 | smd 1 x 0.8: P$1 -4.15,1.1; P$2 -4.15,-1.1; P$3 4.15,-1.1; P$4 4.15,1.1 | hole 0.9: -1.5,0; 1.5,0
CONDUCTIVE_BUTTON_THICK_STARTSELECT = smd 1.6 x 1.6: P$ACTIVE 3,1; P$ACTIVE1 -1,1; P$ACTIVE2 -3,-1; P$ACTIVE3 1,-1; P$GND 1,1; P$GND1 -3,1; P$GND2 -1,-1; P$GND3 3,-1 | smd 2.54 x 0.185 rotated 45: P$ACTIVE4 -2,0 | smd 2.54 x 0.185 rotated 135: P$ACTIVE5 0,0 | smd 2.54 x 0.185 rotated 225: P$ACTIVE6 2,0
TPS613222A = smd 0.55 x 1.2: GND 0,-1.3; NC1 0.95,-1.3; NC2 -0.95,1.3; SW -0.95,-1.3; VOUT 0.95,1.3
SOT23-5-1 = smd 0.55 x 1.2: 1 -0.95,-1.3; 2 0,-1.3; 3 0.95,-1.3; 4 0.95,1.3; 5 -0.95,1.3
ILI9342-2.6" = smd 0.4 x 3: P$1 -20,-8.12; P$2 -19.2,-8.12; P$3 -18.4,-8.12; P$4 -17.6,-8.12; P$5 -16.8,-8.12; P$6 -16,-8.12; P$7 -15.2,-8.12; P$8 -14.4,-8.12; P$9 -13.6,-8.12; P$10 -12.8,-8.12; P$11 -12,-8.12; P$12 -11.2,-8.12; P$13 -10.4,-8.12; P$14 -9.6,-8.12; P$15 -8.8,-8.12; P$16 -8,-8.12; P$17 -7.2,-8.12; P$18 -6.4,-8.12; P$19 -5.6,-8.12; P$20 -4.8,-8.12; P$21 -4,-8.12; P$22 -3.2,-8.12; P$23 -2.4,-8.12; P$24 -1.6,-8.12; P$25 -0.8,-8.12; P$26 0,-8.12; P$27 0.8,-8.12; P$28 1.6,-8.12; P$29 2.4,-8.12; P$30 3.2,-8.12; P$31 4,-8.12; P$32 4.8,-8.12; P$33 5.6,-8.12; P$34 6.4,-8.12; P$35 7.2,-8.12; P$36 8,-8.12; P$37 8.8,-8.12; P$38 9.6,-8.12; P$39 10.4,-8.12; P$40 11.2,-8.12; P$41 12,-8.12; P$42 12.8,-8.12; P$43 13.6,-8.12; P$44 14.4,-8.12; P$45 15.2,-8.12; P$46 16,-8.12; P$47 16.8,-8.12; P$48 17.6,-8.12; P$49 18.4,-8.12; P$50 19.2,-8.12; P$51 20,-8.12
SOIC8 = smd 0.6 x 2.2: 1 -1.905,-2.6; 2 -0.635,-2.6; 3 0.635,-2.6; 4 1.905,-2.6; 5 1.905,2.6; 6 0.635,2.6; 7 -0.635,2.6; 8 -1.905,2.6
MGB-001 = hole 2.6: 67.6,107.8; 2.15,106.8; 1.9,63.8; 67.6,63.8; 67.1,29.15; 29.1,33.6; 22.7,22.4; 2.05,23.5 | hole 3.8: 56.6,31.1 | hole 2.2: 53.6,41.1; 23.7,27.2 | hole 3.5: 46.6,22.4

### Placement (x,y rotation side)
A  64.22,38.7 180 top
B  50.17,34.21 180 top
C1  26.75,88 90 bottom
C2  27.75,108 270 bottom
C3  27.75,103.5 90 bottom
C4  11.75,91 180 bottom
C7  6.75,7 0 bottom
C8  23.75,5.87 180 bottom
C9  6.75,4.59 0 bottom
C10  23.75,9 0 bottom
D1  23.75,104.5 0 bottom
D4  10.75,87 270 bottom
DOWN  13.95,29.4 90 top
J1  40.85,4 90 top
J2  50,7.5 270 bottom
J3  63.55,24.2 0 bottom
J4  2,88.8 90 bottom
L1  18.25,105 90 bottom
LED2  5.25,99.5 90 top
LEFT  6.45,36.9 0 top
PI1  70.75,71 0 bottom
Q3  13.75,88 90 bottom
R1  32.75,88 90 bottom
R2  23.75,102.5 180 bottom
R3  13.75,85 0 bottom
R4  6,94.75 0 bottom
R5  6,104 180 bottom
R16  60.75,89 90 bottom
R17  11.25,75 270 bottom
R18  50,11 270 bottom
R19  14.25,12 270 bottom
RIGHT  21.45,36.9 180 top
S3  12.75,113 180 bottom
SELECT  30.8,16.01 0 top
START  42.41,16.01 0 top
U1  22.25,107.5 90 bottom
U4  29.75,88 0 bottom
U5  37.5,84 0 top
U6  13.75,6.5 90 bottom
U$1  1.75,0 0 top
UP  13.95,44.4 270 top

### Tracks (layer width: path | path; a pad name or v marks a point on that pad's centre or on a via)
3V3  (via drill 0.35)
  Top 0.406: U5.P$46 U5.P$45 U5.P$44 U5.P$43 51.1,82 | U5.P$7 U5.P$6 21.5,81.75 21.25,82
  Top 0.61: PI1.17 42.06,82 | 42.06,82 51.1,82 62.38,82 PI1.1 | 42.06,82 21.25,82 13.25,82 v13.25,67 v13.25,62 | v13.25,16.25 v13.25,3
  Bottom 0.61: PI1.1 62.38,93 R16.5 | v13.25,67 R17.5 | v13.25,16.25 v13.25,62 | C9.1 U6.1 13.25,4.59 | 13.25,4.59 v13.25,3 | R19.2 14.25,5.59 13.25,4.59
  pour Top (rank 3, no thermals): 21.35,74.4 22.45,74.4 22.45,82.25 21.35,82.25
  pour Top (rank 3, no thermals): 50.98,74.4 53.7,74.4 53.7,80 53.2,80.55 53.2,82.25 50.98,82.25
5V
  Bottom 0.508: U1.VOUT 25.5,108.45 26.7,107.25 C2.2 | D1.C 27.5,104.5 C3.2
  Bottom 0.813: C3.2 27.75,105.75 | 27.75,105.75 C2.2 | 61,98.77 61,102.25 57.5,105.75 27.75,105.75
  Bottom 1.27: PI1.2 61,98.77 PI1.4
  pour Bottom (no thermals): 58.75,108 27.25,108 26.25,109 22.75,109 22.75,108 23.75,108 24.75,107 24.75,103.5 56.5,103.5 58.75,101.25 58.75,98.5 59.38,97.88 62.88,97.88 63.5,98.5 63.5,103.25
A  (via drill 0.35)
  Top 0.5: v51.75,57 64.22,44.53 A.P$ACTIVE
  Bottom 0.5: PI1.7 54.76,95.51 51.25,92 51.25,57.5 v51.75,57
AUDIO  (via drill 0.35)
  Top 0.406: v38.75,64 v48.41,64
  Bottom 0.305: PI1.12 48.41,97.5 v48.41,64
  Bottom 0.406: C7.2 9.75,10.75 9.75,61.71 12.04,64 v38.75,64
B  (via drill 0.35)
  Top 0.5: B.P$ACTIVE 50.17,55 49.75,55.42 v49.75,57
  Bottom 0.5: v49.75,57 49.68,57.07 PI1.11
BRIGHTNESS  (via drill 0.35)
  Top 0.406: U5.P$47 v54.3,81
  Bottom 0.406: R16.3 54.3,89 v54.3,81
BYP
  Bottom 0.61: U6.7 C8.1
CSX  (via drill 0.35)
  Top 0.305: PI1.24 35.69,97.53 v35.69,83
  Top 0.406: U5.P$29 39.9,79 v35.69,79
  Bottom 0.406: v35.69,83 v35.69,79
D+  (via drill 0.35)
  Top 0.406: v9.25,83 v9.25,92
  Bottom 0.406: PI1.PP22-USB_D+ 28.75,66 9.25,66 v9.25,83 | v9.25,92 6.75,92 6.75,88.8 J4.3
D-  (via drill 0.35)
  Top 0.406: v8.25,83 v8.25,89.8
  Bottom 0.406: PI1.PP23-USB_D- 30.5,65 8.25,65 v8.25,83 | v8.25,89.8 8.25,88.15 J4.2
D/CX  (via drill 0.35)
  Top 0.305: v43.35,83 43.35,97.47 PI1.18
  Top 0.406: U5.P$31 41.5,80 v43.35,80
  Bottom 0.406: v43.35,80 v43.35,83
DC_VOL  (via drill 0.35)
  Top 0.61: v11.15,62 11.15,75 v10.75,75
  Bottom 0.61: v10.75,75 R17.3 | U6.4 v11.15,62
DOWN  (via drill 0.35)
  Top 0.5: PI1.29 26.82,83.07 v26.75,83 | v26.75,68 26.75,33.58 25.17,32 12.25,32 12.2,31.95 DOWN.P$ACTIVE
  Bottom 0.5: v26.75,68 v26.75,83
GND  (via drill 0.35)  (1 unrouted)
  other vias: 16.75,91.5 19.75,7.13 27.25,5.87 18.75,79.5 18.75,11.01
  pour Top (rank 5, no thermals): 1.75,0 37.25,0 37.25,1.75 44.25,1.75 44.25,0 52.25,0 52.25,16.95 71.25,16.95 71.25,81.5 72,81.5 72,96.5 71.25,96.5 71.25,113 18.75,113 18.75,114 18.25,114 18.25,114.5 15.75,114.5 15.75,114 9.75,114 9.75,114.5 7.25,114.5 7.25,114 6.75,114 6.75,113 1.75,113 1.75,94 0,94 0,67.5 1.75,67.5 1.75,50 1.75,24
  pour Bottom (rank 5, no thermals): 1.75,0 37.25,0 37.25,1.75 44.25,1.75 44.25,0 52.25,0 52.25,16.95 71.25,16.95 71.25,81.5 72,81.5 72,96.5 71.25,96.5 71.25,113 18.75,113 18.75,114 18.25,114 18.25,114.5 15.75,114.5 15.75,114 9.75,114 9.75,114.5 7.25,114.5 7.25,114 6.75,114 6.75,113 1.75,113 1.75,94 0,94 0,67.5 1.75,67.5
HEADPHONES
  Bottom 0.61: 38.35,12.75 R19.1 14.13,12.75 13.25,11.87 13.25,8.39 12,7.13 U6.3 | 38.35,12.75 J1.RSH | 38.35,12.75 39.82,12.75 43.35,9.22 J1.TSH
LEFT  (via drill 0.35)
  Top 0.5: v20.75,68 9.18,56.44 9.18,39.94 7.9,38.65 LEFT.P$ACTIVE | PI1.35 19.2,84.55 v20.75,83
  Bottom 0.5: v20.75,68 v20.75,83
N$1
  Bottom 0.508: R2.1 21.9,103.6 D1.A 20.95,105.45 U1.SW 20.95,106.14 L1.2
  pour Bottom (rank 2, no thermals): 23.75,102 23.75,105 21.75,106.85 16.75,106.85 16.75,105.25 19.75,105.25 22.25,102.75 22.25,102
N$2
  Bottom 0.61: C3.1 27.5,102.5 R2.2
POWER  (via drill 0.35)
  Top 0.61: v15,104 v12,104
  Bottom 0.61: S3.S v15,104 18.11,104 L1.1 | R5.2 v12,104
POWER_LED
  Bottom 0.61: R5.1 LED2.3
PROG
  Bottom 0.508: R1.2 31.25,88.75 U4.5
RESET  (via drill 0.35)
  Top 0.305: v38.23,83 38.23,97.53 PI1.22
  Top 0.406: v38.23,81 24.7,81 U5.P$10
  Bottom 0.406: v38.23,83 v38.23,81
RIGHT  (via drill 0.35)
  Top 0.5: PI1.31 24.28,83.47 v24.75,83 | v24.75,68 24.75,46.5 18.25,40 18.25,37.48 RIGHT.P$ACTIVE
  Bottom 0.5: v24.75,68 v24.75,83
SCL  (via drill 0.35)
  Top 0.305: PI1.23 v34.44,83
  Top 0.406: U5.P$30 40.7,80 v34.44,80
  Bottom 0.406: v34.44,83 v34.44,80
SDI  (via drill 0.35)
  Top 0.305: PI1.19 v39.52,83
  Top 0.406: U5.P$42 50.3,81 v39.52,81
  Bottom 0.406: v39.52,83 v39.52,81
SELECT  (via drill 0.35)  (6 unrouted)
  Top 0.5: SELECT.P$ACTIVE 33.8,47.05 v43.75,57
  Bottom 0.5: PI1.15 44.6,57.85 v43.75,57
SOURCE  (via drill 0.35)
  Top 0.61: v11,94.5 v11,92.5
  Bottom 0.61: Q3.2 10.75,88.95 D4.C 11,88.85 C4.1 v11,92.5 | S3.P 13.5,102 11,99.5 v11,94.5
START  (via drill 0.35)  (6 unrouted)
  Top 0.5: v46.75,57 46.75,55 41.41,49.66 START.P$ACTIVE1
  Bottom 0.5: PI1.13 47.14,57.39 v46.75,57
STAT
  Bottom 0.508: U4.1 30.7,87.27 29.75,88.22 29.75,90.06 26.31,93.5 8,93.5 R4.1
STAT_LED
  Bottom 0.61: R4.2 LED2.1
UP  (via drill 0.35)
  Top 0.5: PI1.33 21.74,84.01 v22.75,83 | v22.75,68 22.75,46 18.75,42 16.25,42 15.75,42.5 15.75,43.48 UP.P$ACTIVE
  Bottom 0.5: v22.75,68 v22.75,83
VBAT
  Bottom 0.508: U4.3 26.75,86.7 C1.1 15.5,87.25 Q3.3
  Bottom 0.61: U4.3 28.8,78 40.75,66.05 40.75,41.88 62.13,20.5 J3.2
VBUS
  Bottom 0.406: 10.75,87.05 D4.A | Q3.1 10.75,87.05 | J4.1 10.3,87.5 10.75,87.05
  Bottom 0.508: Q3.1 13.75,88.05 13.75,88.47 14.94,89.66 28.44,89.66 U4.4
  Bottom 0.61: R3.2 10.75,85 D4.A
VIN
  Bottom 0.61: U6.2 8.63,5.87 C7.1
VIN1
  Top 0.61: J1.RING 37.67,10.92 44.03,10.92 J1.TIP
  Bottom 0.61: C10.- J1.RING | J1.TIP 47.2,10.25 R18.2
VOUT1
  Bottom 0.61: U6.5 22.27,8.4 C10.+ 24.27,7 49.5,7 J2.1
VOUT2
  Bottom 0.61: U6.8 29.75,4.59 31.16,6 48.96,6 J2.2
(copper drawn outside any net)
  shapes: Bottom area x4

### Text on the board
bNames: ! | SCREW | RED WIRE | BLACK WIRE | SCREW | ⇪ | ⇪ | SCREW